# Altium project ECE_1895_Team_Upsilon_Final_BOP_IT_Main.PrjPcb
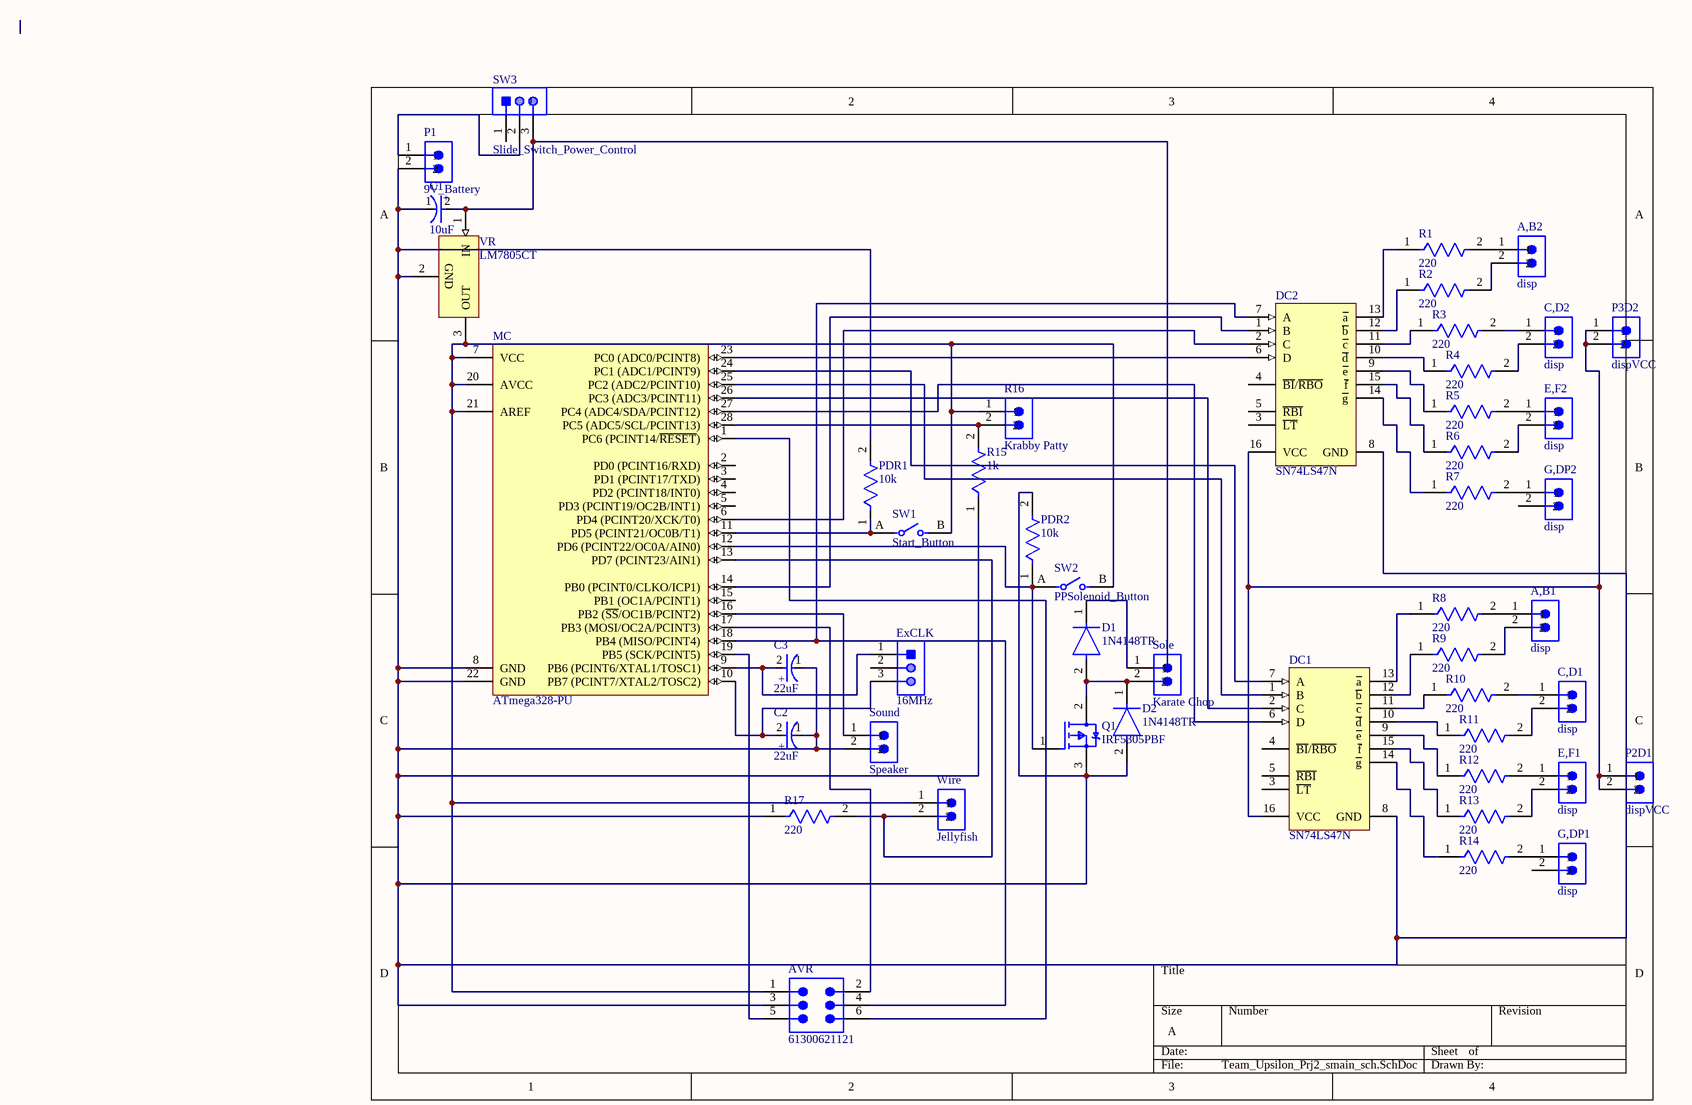
[diagram p0: Team_Upsilon_Prj2_smain_sch.SchDoc]
1 sheet, 48 parts. Net scope: global (net labels, ports and power ports of the same name join across sheets).
Board file: Team_Upsilon_Prj2_smain_pcb.PcbDoc

## Sheet Team_Upsilon_Prj2_smain_sch.SchDoc
size A; SheetNumber: 1; SheetTotal: 1

### Parts
A,B1  disp  [61300211121]
A,B2  disp  [61300211121]
AVR  61300621121  [61300621121]
C1  10uF  [FP-RAD-TH-D_10_0_5-L_20_2-MFG]
C2  22uF  [FP-RAD-TH-D_10_0_5-L_20_2-MFG]
C3  22uF  [FP-RAD-TH-D_10_0_5-L_20_2-MFG]
C,D1  disp  [61300211121]
C,D2  disp  [61300211121]
D1  1N4148TR  [FP-017AG-MFG]
D2  1N4148TR  [FP-017AG-MFG]
DC1  SN74LS47N  [N0016A]
DC2  SN74LS47N  [N0016A]
E,F1  disp  [61300211121]
E,F2  disp  [61300211121]
ExCLK  16MHz  [MOLX-22-28-4033_V]
G,DP1  disp  [61300211121]
G,DP2  disp  [61300211121]
MC  ATmega328-PU  [28P3]
P1  9V_Battery  [61300211121]
P2D1  dispVCC  [61300211121]
P3D2  dispVCC  [61300211121]
PDR1  10k  [FP-MBB0207-MFG]
PDR2  10k  [FP-MBB0207-MFG]
Q1  IRF5305PBF  [FP-PG-TO220-3-0]
R1  220  [FP-MBB0207-MFG]
R2  220  [FP-MBB0207-MFG]
R3  220  [FP-MBB0207-MFG]
R4  220  [FP-MBB0207-MFG]
R5  220  [FP-MBB0207-MFG]
R6  220  [FP-MBB0207-MFG]
R7  220  [FP-MBB0207-MFG]
R8  220  [FP-MBB0207-MFG]
R9  220  [FP-MBB0207-MFG]
R10  220  [FP-MBB0207-MFG]
R11  220  [FP-MBB0207-MFG]
R12  220  [FP-MBB0207-MFG]
R13  220  [FP-MBB0207-MFG]
R14  220  [FP-MBB0207-MFG]
R15  1k  [FP-MBB0207-MFG]
R16  Krabby Patty  [61300211121]
R17  220  [FP-MBB0207-MFG]
Sole  Karate Chop  [61300211121]
Sound  Speaker  [61300211121]
SW1  Start_Button  [FP-EVQ11Y04K-MFG]
SW2  PPSolenoid_Button  [FP-EVQ11Y04K-MFG]
SW3  Slide_Switch_Power_Control  [MOLX-22-28-4033_V]
VR  LM7805CT  [FAIR-TO-220-3]
Wire  Jellyfish  [61300211121]

### Nets
NetA,B1_1: A,B1.1 R8.2
NetA,B1_2: A,B1.2 R9.2
NetA,B2_1: A,B2.1 R1.2
NetA,B2_2: A,B2.2 R2.2
NetAVR_1: AVR.1 MC.7(VCC) MC.20(AVCC) MC.21(AREF) R16.1 SW1.B SW2.B VR.3(OUT) Wire.1
NetAVR_2: AVR.2 MC.17(PB3_(MOSI/OC2A/PCINT3))
NetAVR_3: AVR.3 C1.1(C) C2.1(C) C3.1(C) D2.2(A) DC1.8(GND) DC2.8(GND) MC.8(GND) MC.22(GND) P1.2 PDR1.2 PDR2.2 Q1.3(S) R15.1 R17.1 Sound.2 VR.2(GND)
NetAVR_4: AVR.4 DC2.7(A) MC.18(PB4_(MISO/PCINT4))
NetAVR_5: AVR.5 MC.19(PB5_(SCK/PCINT5))
NetAVR_6: AVR.6 MC.1(PC6_(PCINT14/~{RESET}))
NetC1_2: C1.2(A) SW3.3 VR.1(IN)
NetC2_2: C2.2(A) ExCLK.3 MC.10(PB7_(PCINT7/XTAL2/TOSC2))
NetC3_2: C3.2(A) ExCLK.1 MC.9(PB6_(PCINT6/XTAL1/TOSC1))
NetC,D1_1: C,D1.1 R10.2
NetC,D1_2: C,D1.2 R11.2
NetC,D2_1: C,D2.1 R3.2
NetC,D2_2: C,D2.2 R4.2
NetD1_1: D1.1(C) Sole.1
NetD1_2: D1.2(A) D2.1(C) Q1.2(D) Sole.2
NetDC1_1: DC1.1(B) MC.25(PC2_(ADC2/PCINT10))
NetDC1_2: DC1.2(C) MC.26(PC3_(ADC3/PCINT11))
NetDC1_6: DC1.6(D) MC.27(PC4_(ADC4/SDA/PCINT12))
NetDC1_7: DC1.7(A) MC.24(PC1_(ADC1/PCINT9))
NetDC1_9: DC1.9(~{e}) R12.1
NetDC1_10: DC1.10(~{d}) R11.1
NetDC1_11: DC1.11(~{c}) R10.1
NetDC1_12: DC1.12(~{b}) R9.1
NetDC1_13: DC1.13(~{a}) R8.1
NetDC1_14: DC1.14(~{g}) R14.1
NetDC1_15: DC1.15(~{f}) R13.1
NetDC1_16: DC1.16(VCC) DC2.16(VCC) P2D1.1 P2D1.2 P3D2.1 P3D2.2
NetDC2_1: DC2.1(B) MC.14(PB0_(PCINT0/CLKO/ICP1))
NetDC2_2: DC2.2(C) MC.6(PD4_(PCINT20/XCK/T0))
NetDC2_6: DC2.6(D) MC.23(PC0_(ADC0/PCINT8))
NetDC2_9: DC2.9(~{e}) R5.1
NetDC2_10: DC2.10(~{d}) R4.1
NetDC2_11: DC2.11(~{c}) R3.1
NetDC2_12: DC2.12(~{b}) R2.1
NetDC2_13: DC2.13(~{a}) R1.1
NetDC2_14: DC2.14(~{g}) R7.1
NetDC2_15: DC2.15(~{f}) R6.1
NetE,F1_1: E,F1.1 R12.2
NetE,F1_2: E,F1.2 R13.2
NetE,F2_1: E,F2.1 R5.2
NetE,F2_2: E,F2.2 R6.2
NetG,DP1_1: G,DP1.1 R14.2
NetG,DP2_1: G,DP2.1 R7.2
NetMC_11: MC.11(PD5_(PCINT21/OC0B/T1)) PDR1.1 SW1.A
NetMC_12: MC.12(PD6_(PCINT22/OC0A/AIN0)) PDR2.1 Q1.1(G) SW2.A
NetMC_13: MC.13(PD7_(PCINT23/AIN1)) R17.2 Wire.2
NetMC_16: MC.16(PB2_(~{SS}/OC1B/PCINT2)) Sound.1
NetMC_28: MC.28(PC5_(ADC5/SCL/PCINT13)) R15.2 R16.2
NetP1_1: P1.1 SW3.2

Not connected (* = marked no-connect by the designer): DC1 3(~{LT}) 4(~{BI}/~{RBO}) 5(~{RBI}); DC2 3(~{LT}) 4(~{BI}/~{RBO}) 5(~{RBI}); ExCLK 2; G,DP1 2; G,DP2 2; MC 2(PD0_(PCINT16/RXD)) 3(PD1_(PCINT17/TXD)) 4(PD2_(PCINT18/INT0)) 5(PD3_(PCINT19/OC2B/INT1)) 15(PB1_(OC1A/PCINT1)); SW3 1

### Notes on the sheet
- (in symbol CMP-05427-001613-1) +

### Library data of the parts
A,B1 A,B2 C,D1 C,D2 E,F1 E,F2 G,DP1 G,DP2 P1 P2D1 P3D2 R16 Sole Sound Wire = CMP-1712-00002-6: NexarPartId: 20081794; Number of Contacts: 2; Pitch: 2.54mm; Connector Type: Male Pin; Voltage Rating: 250V; Current Rating: 3A; Gender: Male; Contact Resistance: 20mΩ; Height: 8.94mm; Lead Free: Lead Free; Number of Pins: 2; Termination: Through Hole; RoHS: Compliant; Lead Pitch: 2.54mm; REACH SVHC: No SVHC; Housing Material: PBT; Contact Mating Length: 5.9944mm; Min Operating Temperature: -40°C; Orientation: Vertical; Contact Material: Copper; Contact Gender: Male; Max Operating Temperature: 125°C; Number of Rows: 1; Number of Positions: 2; Packaging: Bulk; Contact Plating: Gold; Mount: Through Hole; Color: Black; Operating Supply Voltage: 250V
AVR = CMP-1502-01072-3: NexarPartId: 32855529; Row Spacing: 2.54mm; Current Rating: 3A; Voltage Rating: 250V; Contact Resistance: 20mΩ; Connector Type: Male Pin; Number of Positions: 6; Gender: Male; Termination: Solder; Orientation: Vertical; Max Operating Temperature: 105°C; Contact Plating: Gold; Height: 8.89mm; Contact Mating Length: 5.9944mm; Mount: Through Hole; Min Operating Temperature: -40°C; Lead Pitch: 2.54mm; Number of Pins: 6; Operating Supply Voltage: 250V; Color: Black; Pitch: 2.54mm; Packaging: Bulk; Contact Material: Copper; REACH SVHC: Unknown; RoHS: Compliant; Number of Rows: 2; Number of Contacts: 6
C1-C3 = CMP-05427-001613-1: Aluminum Electrolytic Capacitors (Radial Lead Type) 10uF ±20% 400V; Lead Diameter: 0.6mm; Life (Hours): 8000Hour; Ripple Current (AC): 300mA; Dissipation Factor: 0.24%; Dielectric Material: Aluminium; Polarity: Polar; Voltage: 400V; Number of Pins: 2; Height: 20mm; Case/Package: Radial; REACH SVHC: No SVHC; Max Operating Temperature: 105°C; Construction: RADIAL; Voltage Rating (DC): 400V; Tolerance: 20%; Voltage Rating: 400V; Contact Plating: Tin; Ripple Current: 300mA; Min Operating Temperature: -25°C; Packaging: Bulk; Lead Free: Lead Free; Diameter: 10mm; Height - Seated (Max): 0.787inch; Radiation Hardening: No; Capacitance: 10uF; Termination: Radial; Length: 20mm; Series: ED; Package Quantity: 200; Mount: Through Hole; Lead Pitch: 5mm; RoHS Compliant: Yes
D1 D2 = CMP-07163-000030-1: DIODE GEN PURP 100V 200MA DO35; Manufacturer: ON Semiconductor; Peak Reverse Current: 5uA; Value: 4pF; Max Junction Temp: +175°C; Max Surge Forward Current: 1A; Footprint Url: https://www.onsemi.com/pub/Collateral/017AG.PDF; Temperature Range Low: -55°C; Max Repetitive Reverse Voltage: 100V; Temperature Range High: +175°C; Reverse Voltage: 100V; ComponentLink2URL: https://www.onsemi.com/pub/Collateral/1N914A-D.pdf; Category: Diode; Package: 017AG; Octopart: https://octopart.com/1n4148tr-on+semiconductor-84323125; Device Class L1: Discrete Semiconductors; Manufacturer Part Number: 1N4148TR; Forward Current: 200mA; Temperature: -55°C to +175°C; Lead Free: Yes; Digikey Description: DIODE GEN PURP 100V 200MA DO35; Mouser Description: 1N4148 Series 100 V 500 mW Small Signal Fast Switching Diode - DO-35; Automotive: No; Device Class L2: Diodes; Device Class L3: Rectifier Diodes; Height: 1.91mm; ComponentLink2Description: Datasheet; RoHS: TRUE; Capacitance: 4pF
DC1 DC2 = CMP-0388-00303-2: BCD-to-7-Segment Decoder / Driver, 4.75 to 5.25 V, 0 to 70 degC, 16-pin DIP (N16), Pb-Free (RoHS); Manufacturer: Texas Instruments; Rating: Catalog; SubFamily: Discrete Segment LED Driver; Vin(Max)(V): 5.25; Vin(Min)(V): 4.75; Eco-Plan: Pb-Free (RoHS); ComponentLink1URL: http://www.ti.com/; PackageReference: N0016A; PackageDescription: 16-Pin Plastic In-Line, Body 19.305 x 6.35 mm, Pitch 2.54 mm; ComponentLink1Description: Manufacturer URL; ComponentLink2URL: http://www.ti.com/general/docs/lit/getliterature.tsp?genericPartNumber=SN74LS47&fileType=pdf; Mounting Technology: Through Hole; ComponentLink3URL: http://www.ti.com/litv/pdf/mpdi002c; Code_JEDEC: MS-001; DatasheetVersion: SDLS111; PartNumber: SN74LS47N; ComponentLink2Description: Datasheet; ComponentLink3Description: Package Specification; PackageVersion: 4040049/E
ExCLK SW3 = CMP-1676-00001-5: Male Header, Pitch 2.54 mm, 1 x 3 Position, Height 8.38 mm, Tail Length 3.18 mm, RoHS, Bulk; Manufacturer: Molex; Rows: 1; Voltage Rating: 250 V; Current Rating: 4 A; Min Operating Temperature: 0 degC; Lead Pitch: 0.1 inch; Packaging: Bulk; Contact Finish: Gold; RoHSCompliant: true; Contact Material: Brass; PackageReference: 22-28-4033; REACH SVHC: Unknown; PackageDescription: Male Header, Pitch 2.54 mm, 1 x 3 Position, Height 8.38 mm, Tail Length 3.18 mm; ComponentLink2URL: http://www.molex.com/pdm_docs/sd/022284033_sd.pdf; Height: 8.38 mm; Mounting Technology: Through Hole; ComponentLink1Description: Manufacturer URL; Length: 7.62 mm; Mount: Through Hole; DatasheetVersion: Rev. G, 01/2012; Max Operating Temperature: 75 degC; ComponentLink2Description: Datasheet; Colour: Black; Pins: 3; Contact Plating: Gold; Package Quantity: 1; ComponentLink1URL: http://www.molex.com/
MC = CMP-0095-00015-2: 8-bit AVR Microcontroller, 32KB Flash, 1KB EEPROM, 2KB SRAM, 28-pin PDIP, Industrial Grade (-40°C to 85°C); ComponentLink3Description: ATmega48A/48PA/88A/88PA/168A/168PA/328/328P Summary; RevisionNote: DatasheetVersion updated. URLs added.; DatasheetVersion: revD, May-2011; ComponentLink1URL: http://www.atmel.com/; PackageVersion: revB, Sep-2001; PackageDescription: 28-lead (0.300"/7.62mm Wide) Plastic Dual Inline Package (PDIP); PackageReference: 28P3; ComponentLink1Description: Manufacturer URL; ComponentLink2Description: ATmega48A/48PA/88A/88PA/168A/168PA/328/328P Datasheet; ComponentLink3URL: http://www.atmel.com/dyn/resources/prod_documents/8271S.pdf; ComponentLink2URL: http://www.atmel.com/dyn/resources/prod_documents/8271.pdf
PDR1 PDR2 R1-R15 R17 = CMP-02408-000035-1: RES 10K OHM 0.6W 1% AXIAL; Voltage Rating: 300V; Resistance: 10kR; Max Power Dissipation: 600mW; Temperature Coefficient: 50ppm/°C; Radiation Hardening: No; Case/Package: Conformal; Termination: Axial; Military Standard: Not; Length: 6.5mm; Voltage Rating (DC): 300V; RoHS Compliant: Yes; Number of Terminations: 2; Packaging: Tape and Reel; Features: Automotive AEC-Q200; Tolerance: 1%; Min Operating Temperature: -55°C; Power Rating: 600mW; Lead Free: Lead Free; Resistor Type: Metal Film; Construction: Cylindrical; Series: MBB 0207 - Professional; Max Operating Temperature: 155°C; Diameter: 2.5mm; Resistance Tolerance: 1%; Contact Plating: Tin; Technology: THIN FILM
Q1 = CMP-32901-000003-1: MOSFET P-CH 55V 31A TO-220AB; Manufacturer: Infineon; Max Forward Diode Voltage: -1.3V; Continuous Drain Current: -31A; Standoff Height: 3.55mm; Power Dissipation: 110W; Number Of Channels: 1; Rthja Max: 62°C/W; Depletion Mode: False; Drain To Source Resistance: 0.06Ω; Input Capacitace At Vds: 1200pF @ -25V; Reverse Recovery Time: 71ns; Gate Charge At Vgs: 63nC @ -10V; Gate To Source Voltage: 20V; Turn Off Delay Time: 39ns; Turn On Delay Time: 14ns; Drain To Source Breakdown Voltage: -55V; Threshold Vgs Min: -2V; Max Junction Temp: +175°C; Pulse Drain Current: -110A; Reverse Recovery Charge: 170nC; Threshold Vgs Max: -4V; Device Class L1: Discrete Semiconductors; Lead Free: Yes; Temperature Range High: +175°C; Device Class L2: Transistors; Package: PG-TO220-3; Octopart: https://octopart.com/irf5305pbf-infineon-65873396; RoHS: TRUE; Number Of P Channels: 1; Manufacturer Part Number: IRF5305PBF; Category: Trans; Digikey Description: MOSFET P-CH 55V 31A TO-220AB; Device Class L3: MOSFETs; Height: 19.3mm; Automotive: No; Temperature Range Low: -55°C; Temperature: -55°C to +175°C; ComponentLink2URL: https://www.infineon.com/dgdl/irf5305pbf.pdf?fileId=5546d462533600a4015355e370101993; Drain To Source Voltage: -55V; ComponentLink2Description: Datasheet
SW1 SW2 = CMP-05618-000106-1: SWITCH TACTILE SPST-NO 0.02A 15V; Operating Force: 1.6N; Actuator Type: Standard; Actuator Length: 0.4mm; Actuator Color: Black; Mechanical Life: 1000000Cycles; Switch Function: Off-Mom; Contact Resistance: 50mR; Switch Travel: 0.25mm; Throw Configuration: SPST; Illumination Type: Non-Illuminated; Package Quantity: 1; Max Operating Temperature: 70°C; Case/Package: Radial; Radiation Hardening: No; Packaging: Tape and Reel; Termination: PC Pin; Orientation: Straight; Min Operating Temperature: -20°C; Lead Free: Lead Free; Electrical Life: 1000000Cycles; RoHS Compliant: Yes; Max Voltage Rating (DC): 15V; Mount: Through Hole; Series: EVQ11; Size: 6mm
VR = CMP-2000-04938-1: Positive Voltage Regulator, 5 V, 1 A, -40 to 125 degC, 3-Pin TO-220, RoHS, Tube; Manufacturer: FairchildSemiconductor; Maximum Input Voltage: 35V; Maximum Quiescent Current: 8mA; Load Regulation: 100mV; Maximum Output Current: 2.2(Typ)A; Output Type: Fixed; Typical Dropout Voltage @ Current: 2@1AV; Rad Hard: No; Output Voltage: 5V; Accuracy: ±4%; Number of Outputs: 1; Category: LinearRegulator; Package Description: 3-Pin Through Hole Device, Body 10 x 4.5 mm, Pitch 2.54 mm; Packaging: Rail/Tube; Mounting: ThroughHole; Polarity: Positive; Manufacturer URL: https://www.fairchildsemi.com/; Line Regulation: 100mV; Datasheet Version: Aug-12; Datasheet URL: https://datasheet.ciiva.com/26904/lm7805ct-26904988.pdf; Package Reference: TO-220; Package URL: https://www.fairchildsemi.com/package-drawings/TO/TO220B03.pdf; Package: 3TO-220AB; Operating Temperature: -40to125degC; Type: Linear